# EAGLE schematic ecg_final (EAGLE 9.3.0)
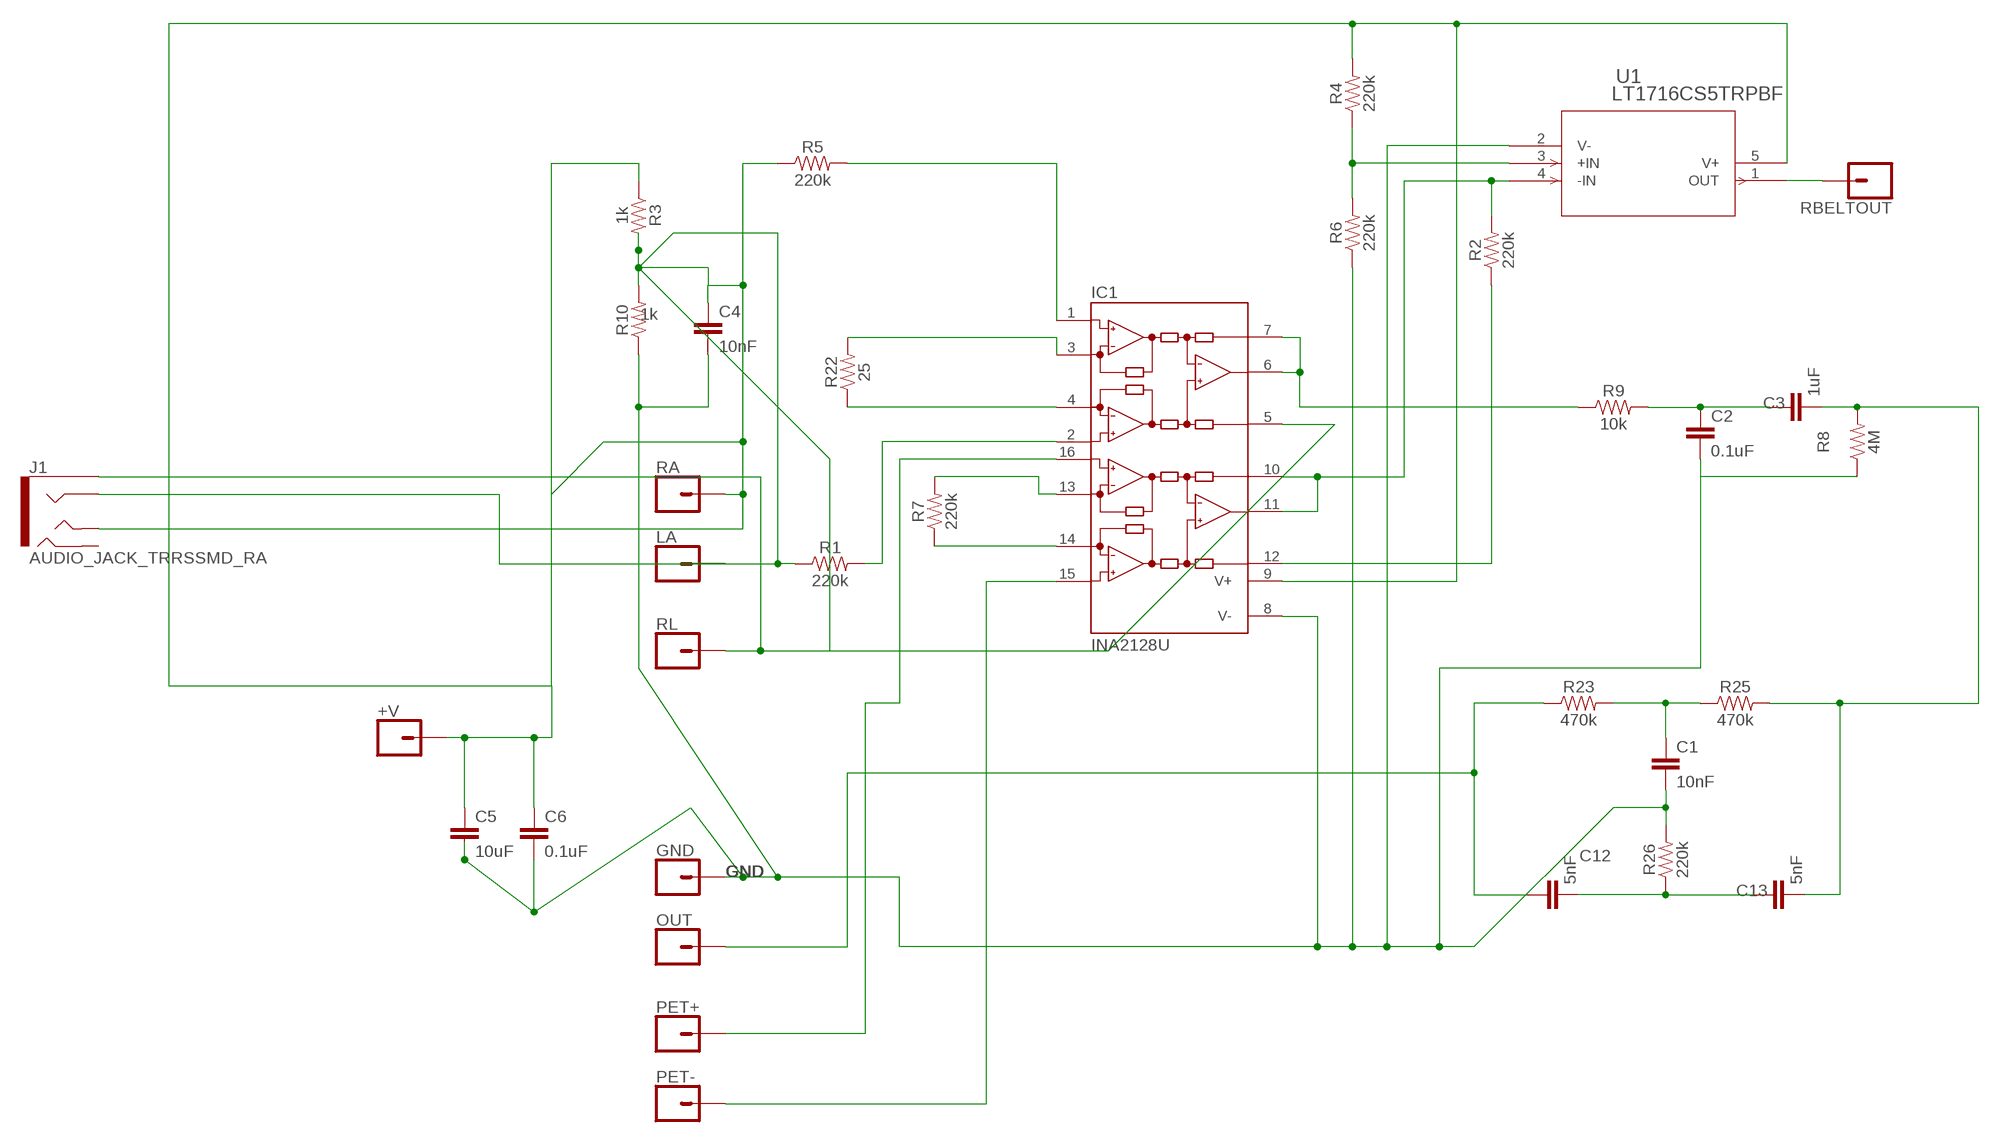
[diagram p0: schematic, sheet 1]

## Parts
+V  CONN_01  [1X01]
C1  10nF  10NF-PTH-10MM-10000V-1-%  [CAP-PTH-10MM]
C2  0.1uF  10NF-PTH-10MM-10000V-1-%  [CAP-PTH-10MM]
C3  1uF  10NF-PTH-10MM-10000V-1-%  [CAP-PTH-10MM]
C4  10nF  10NF-PTH-10MM-10000V-1-%  [CAP-PTH-10MM]
C5  10uF  10NF-PTH-10MM-10000V-1-%  [CAP-PTH-10MM]
C6  0.1uF  10NF-PTH-10MM-10000V-1-%  [CAP-PTH-10MM]
C12  5nF  10NF-PTH-10MM-10000V-1-%  [CAP-PTH-10MM]
C13  5nF  10NF-PTH-10MM-10000V-1-%  [CAP-PTH-10MM]
GND  CONN_01  [1X01]
IC1  INA2128U  [SO16-1]
J1  AUDIO_JACK_TRRSSMD_RA  [AUDIO_JACK_3.5MM_TRRS_SMD_RA]
LA  CONN_01  [1X01]
OUT  CONN_01  [1X01]
PET+  CONN_01  [1X01]
PET-  CONN_01  [1X01]
R1  220k  10KOHM-HORIZ-1/4W-1%  [AXIAL-0.3]
R2  220k  10KOHM-HORIZ-1/4W-1%  [AXIAL-0.3]
R3  1k  1KOHM-HORIZ-1/4W-1%  [AXIAL-0.3]
R4  220k  10KOHM-HORIZ-1/4W-1%  [AXIAL-0.3]
R5  220k  10KOHM-HORIZ-1/4W-1%  [AXIAL-0.3]
R6  220k  10KOHM-HORIZ-1/4W-1%  [AXIAL-0.3]
R7  220k  10KOHM-HORIZ-1/4W-1%  [AXIAL-0.3]
R8  4M  1KOHM-HORIZ-1/4W-1%  [AXIAL-0.3]
R9  10k  1KOHM-HORIZ-1/4W-1%  [AXIAL-0.3]
R10  1k  1KOHM-HORIZ-1/4W-1%  [AXIAL-0.3]
R22  25  1KOHM-HORIZ-1/4W-5%  [AXIAL-0.3]
R23  470k  1KOHM-HORIZ-1/4W-5%  [AXIAL-0.3]
R25  470k  1KOHM-HORIZ-1/4W-5%  [AXIAL-0.3]
R26  220k  1KOHM-HORIZ-1/4W-5%  [AXIAL-0.3]
RA  CONN_01  [1X01]
RBELTOUT  CONN_01  [1X01]
RL  CONN_01  [1X01]
U1  LT1716CS5TRPBF  [SOT-5_S]

## Nets
+V: +V.1 C5.1 C6.1 IC1.9(V+) R3.P$1 R4.P$2 U1.5(V+)
GND: C1.2 C2.2 C4.2 C5.2 C6.2 GND.1 IC1.8(V-) R6.P$1 R8.P$1 R10.P$1 R26.P$2 U1.2(V-)
LAA: IC1.2(INA+) R1.P$2
N$3: C12.2 C13.1 R26.P$1
N$4: IC1.6(VOA) IC1.7(SENSEA) R9.P$1
N$8: IC1.4(RGA) R22.P$1
N$9: C2.1 C3.1 R9.P$2
N$10: IC1.1(INA-) R5.P$2
N$12: IC1.10(SENSEB) IC1.11(VOB) R2.P$2 U1.4(-IN)
N$14: IC1.16(INB-) PET+.1
N$15: IC1.12(REFB) R2.P$1
N$16: C1.1 R23.P$2 R25.P$1
N$17: R4.P$1 R6.P$2 U1.3(+IN)
N$18: C3.2 C13.2 R8.P$2 R25.P$2
N$19: IC1.13(RGB) R7.P$2
N$20: IC1.14(RGB) R7.P$1
N$21: IC1.15(INB+) PET-.1
N$22: RBELTOUT.1 U1.1(OUT)
N$23: IC1.3(RGA) R22.P$2
OUT: C12.1 OUT.1 R23.P$1
RL: C4.1 IC1.5(REFA) J1.EARTH J1.RING1 J1.TIP LA.1 R1.P$1 R3.P$2 R5.P$1 R10.P$2 RA.1 RL.1
Unconnected: J1.RING2

## Library data of the parts
+V GND LA OUT PET+ PET- RA RBELTOUT RL = SparkFun-Connectors:CONN_01: Single connection point. Often used as Generic Header-pin footprint for 0.1 inch spaced/style header connections On any of the 0.1 inch spaced packages, you can populate with these: Break Away Headers - Straight <https://www.sparkfun.com/products/116> (PRT-00116) Break Away Male Headers - Right Angle <https://www.sparkfun.com/products/553> (PRT-00553) Female Headers <https://www.sparkfun.com/products/115> (PRT-00115) Break Away Headers - Machine Pin <https://www.sparkfun.com/products/117> (PRT-00117) Break Away Female Headers - Swiss Machine Pin <https://www.sparkfun.com/products/743> (PRT-00743) This device is also useful as a general connection point to wire up your design to another part of your project. Our various solder wires solder well into these plated through hole pads. Hook-Up Wire - Assortment (Stranded, 22 AWG) <https://www.sparkfun.com/products/11375> (PRT-11375) Hook-Up Wire - Assortment (Solid Core, 22 AWG) <https://www.sparkfun.com/products/11367> (PRT-11367) View the entire wire category on our website here <https://www.sparkfun.com/categories/141> Special notes: SMTSO-256-ET is a "flush mount" nut for a 4-40 screw. We mostly use this on specialty testbeds; it is a nice way to connect hardware to your PCB at an adjustable hieght. Also note, the SNAP packages are for using a snappable style connector. We sell a baggie of snaps and they are also used on two LilyPad designs: Snap Assortment - 30 pack (male and female) <https://www.sparkfun.com/products/11347> (DEV-11347) LilyPad Arduino SimpleSnap <https://www.sparkfun.com/products/10941> (DEV-10941) LilyPad SimpleSnap Protoboard <https://www.sparkfun.com/products/10940> (DEV-10940)
C1 C4 = SparkFun-Capacitors:10NF: 0.01uF/10nF/10,000pF ceramic capacitors A capacitor is a passive two-terminal electrical component used to store electrical energy temporarily in an electric field. CAP-09321; PROD_ID: CAP-09321
C2 C3 C5 C6 C12 C13 = SparkFun-Capacitors:10NF: 0.01uF/10nF/10,000pF ceramic capacitors A capacitor is a passive two-terminal electrical component used to store electrical energy temporarily in an electric field. CAP-09321; PROD_ID: CAP-09321; VALUE: 10nF
IC1 = burr-brown:INA2128: Dual Instrumentation Amplifier Low Power; MF: TEXAS INSTRUMENTS; MPN: INA2128U; OC_FARNELL: 1212421; OC_NEWARK: 28C7388
J1 = SparkFun-Connectors:AUDIO_JACK_TRRS: Audio Jack - 3.5mm TRRS (SMD) This is a 3.5mm TRRS SMD audio jack. TRRS connectors are the audio-style connectors that you see on some phones, MP3 players and development boards. TRRS stands for “tip, ring, ring, sleeve,” which reflects that this has three conductors and a ground. SparkFun Products: Audio Jack <https://www.sparkfun.com/products/12639> mbed Starter Kit <https://www.sparkfun.com/products/12968> SparkFun TRRS 3.5mm Jack Breakout <https://www.sparkfun.com/products/11570>; PROD_ID: CONN-10676; SF_ID: PRT-12639
R1 R2 R4-R7 = SparkFun-Resistors:10KOHM: 10kΩ resistor A resistor is a passive two-terminal electrical component that implements electrical resistance as a circuit element. Resistors act to reduce current flow, and, at the same time, act to lower voltage levels within circuits. - Wikipedia; PROD_ID: RES-12183; VALUE: 10k
R3 R10 = SparkFun-Resistors:1KOHM: 1kΩ resistor A resistor is a passive two-terminal electrical component that implements electrical resistance as a circuit element. Resistors act to reduce current flow, and, at the same time, act to lower voltage levels within circuits. - Wikipedia; PROD_ID: RES-12182
R8 R9 = SparkFun-Resistors:1KOHM: 1kΩ resistor A resistor is a passive two-terminal electrical component that implements electrical resistance as a circuit element. Resistors act to reduce current flow, and, at the same time, act to lower voltage levels within circuits. - Wikipedia; PROD_ID: RES-12182; VALUE: 1k
R22 R23 R25 R26 = SparkFun-Resistors:1KOHM: 1kΩ resistor A resistor is a passive two-terminal electrical component that implements electrical resistance as a circuit element. Resistors act to reduce current flow, and, at the same time, act to lower voltage levels within circuits. - Wikipedia; PROD_ID: RES-08380; VALUE: 1k
U1 = LT1716CS5TRPBF:LT1716CS5TRPBF; DESCRIPTION: LT1716 - SOT-23, 44V, Over-The-Top, Micropower, Precision Rail-to-Rail Comparator; DIGI-KEY_PART_NUMBER: LT1716CS5#TRPBFCT-ND; DIGI-KEY_PURCHASE_URL: https://www.digikey.com/product-detail/en/linear-technology-analog-devices/LT1716CS5-TRPBF/LT1716CS5-TRPBFCT-ND/7897918?utm_source=snapeda&utm_medium=aggregator&utm_campaign=symbol; MF: Linear Technology; MP: LT1716CS5#TRPBF; PACKAGE: TSOT-23 Linear Technology